# Altium project Archim.PrjPcb (part 3 of 3)
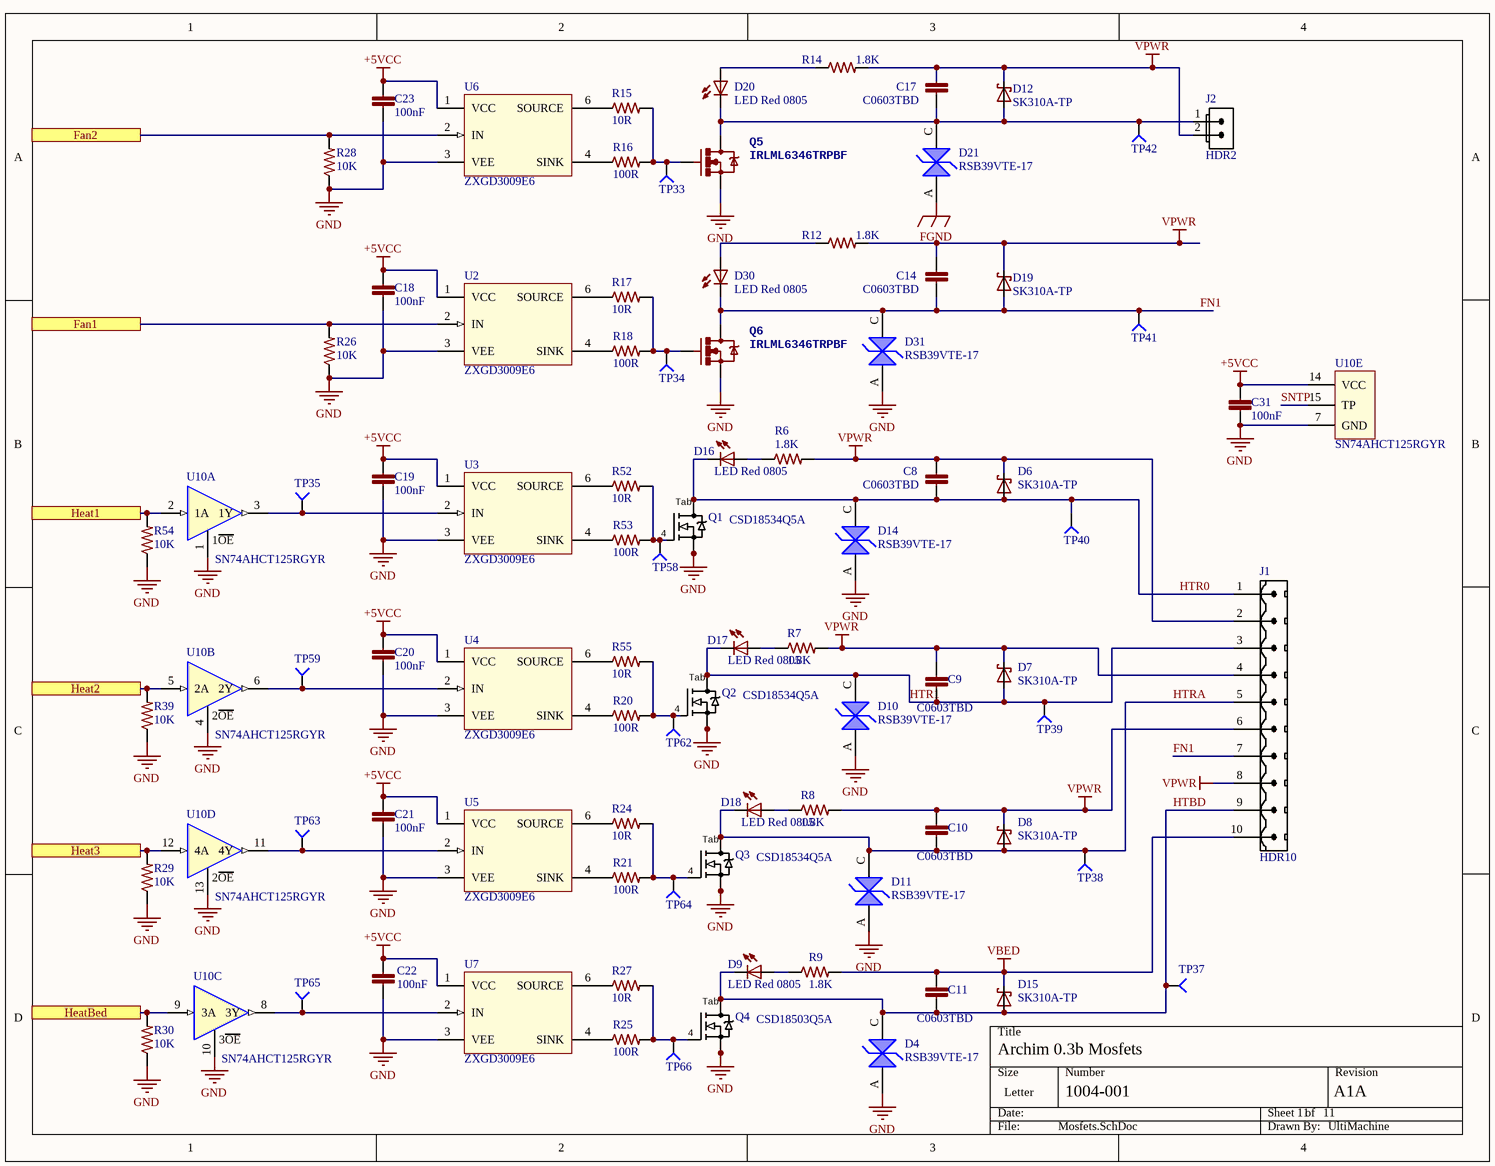
[diagram p8: Mosfets.SchDoc]

## Nets that join several sheets
3.3VCC: Power (C24.1 R33.2 TP47.1 U8.4), USB (11 pins), EndStops (18 pins), Microcontroller (32 pins), Motors (R129#1.2 U13.16 U13.17), Motor-Z (C187.1 R130.2 U17.8), Thermistors (8 pins)
5V-MOT: Power (FB22.2 TP3.TP), Motor-Z (5 pins)
+5VCC: Power (11 pins), USB (JP1.1 R150.2 R151.2), Microcontroller (8 pins), Mosfets (14 pins)
FGND: Power (17 pins), USB (D26.C), Microcontroller (12 pins), Mosfets (D21.A)
GND: Power (67 pins), USB (22 pins), EndStops (30 pins), Microcontroller (58 pins), Motors (24 pins), Motor-Z (34 pins), Thermistors (16 pins), Mosfets (43 pins)
VBED: Power (6 pins), Mosfets (C11.1 D15.C J1.10 R9.2)
VDDANA: USB (C76.1 C77.1 U11#1.75), Microcontroller (5 pins)
VMOT: Power (9 pins), Motor-Z (FB31.2)
VPWR: Power (21 pins), Mosfets (20 pins)
Fan1: Microcontroller (U11#2.137), Mosfets (R26.2 U2.2)
Fan2: Microcontroller (U11#2.136), Mosfets (R28.2 U6.2)
Heat1: Microcontroller (U11#2.135), Mosfets (R54.2 U10.2)
Heat2: Microcontroller (U11#2.134), Mosfets (R39.2 U10.5)
Heat3: Microcontroller (U11#2.133), Mosfets (R29.2 U10.12)
HeatBed: Microcontroller (U11#2.132), Mosfets (R30.2 U10.9)
MAX_ES1: EndStops (C86.1 D13.K R23.1 R35.1), Microcontroller (U11#2.32)
MAX_ES2: EndStops (C158.1 D33.K R73.1 R74.1), Microcontroller (U11#2.18)
MAX_ES3: EndStops (C160.1 D35.K R78.1 R79.1), Microcontroller (U11#2.22)
MIN_ES1: EndStops (C84.1 D3.K R19.1 R22.1), Microcontroller (U11#2.17)
MIN_ES2: EndStops (C157.1 D32.K R63.1 R72.1), Microcontroller (U11#2.19)
MIN_ES3: EndStops (C159.1 D34.K R75.1 R76.1), Microcontroller (U11#2.26)
NetR101_1: Microcontroller (R101.1), Motor-Z (R126.1)
NetR130_1: Microcontroller (U11#2.116), Motor-Z (R130.1 U17.20 U17.21)
NetU11#2_14: Microcontroller (U11#2.14), Motor-Z (U17.5)
NetU11#2_15: Microcontroller (U11#2.15), Motor-Z (U17.3)
NetU11#2_16: Microcontroller (U11#2.16), Motor-Z (U17.4)
NetU11#2_98: Microcontroller (U11#2.98), Motor-Z (U17.7)
NetU11#2_99: Microcontroller (U11#2.99), Motor-Z (U17.6)
NetU11#2_100: Microcontroller (U11#2.100), Motor-Z (U17.2)
NetU11#2_101: Microcontroller (U11#2.101), Motor-Z (U17.22)
NRST: USB (R149.1 R163.1), Microcontroller (D71.C J20.18 J28.6 R145.2)
RESET: USB (C209.2 R162.1 U11#1.47), Microcontroller (C40.1 J4.10 S1.1 TP56.1)
THERM_AN1: Microcontroller (U11#2.90), Thermistors (C103.1 R44.1 TP101.1)
THERM_AN2: Microcontroller (U11#2.89), Thermistors (C161.1 R81.1 TP9.1)
THERM_AN3: Microcontroller (U11#2.91), Thermistors (C162.1 R91.1 TP10.1)
THERM_AN4: Microcontroller (U11#2.88), Thermistors (C163.1 R94.1 TP12.1)